# EAGLE design LedController3 (EAGLE 9.0.0)
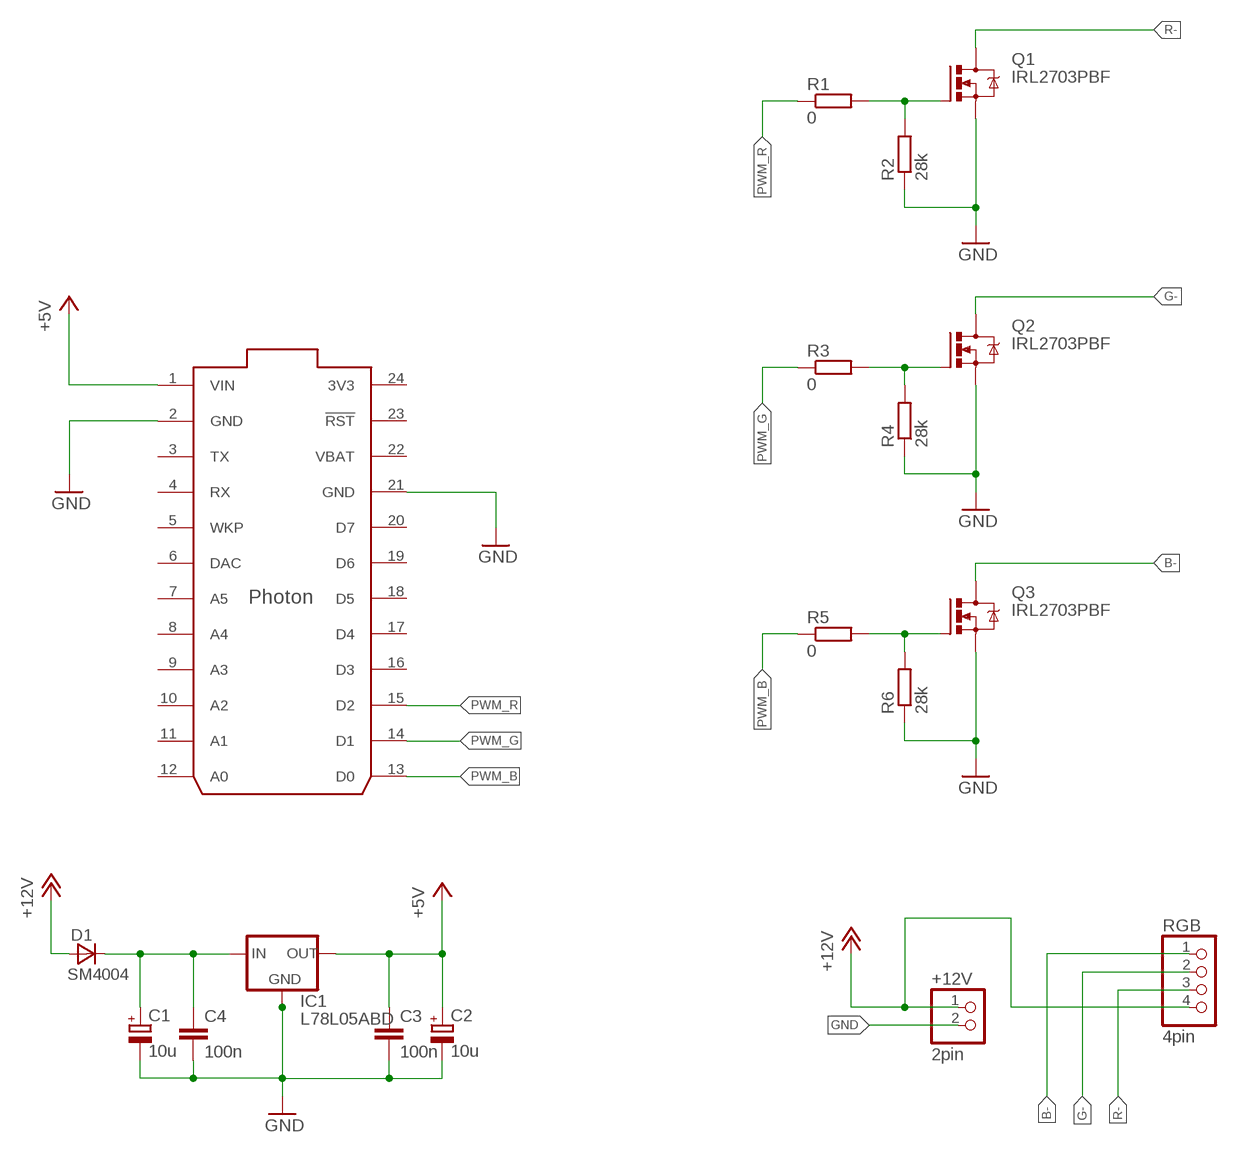
[diagram p0: schematic, sheet 1]

## Parts
+12V  2pin  PINHD-1X2  [1X02]
C1  10u  CPOL-EUSMCC  [SMC_C]
C2  10u  CPOL-EUSMCC  [SMC_C]
C3  100n  C-EUC0805  [C0805]
C4  100n  C-EUC0805  [C0805]
D1  SM4004  [MELF-MLL41]
IC1  L78L05ABD  L78LXXBD/CD  [SO08]
Q1  IRL2703PBF  IRF540  [TO220BV]
Q2  IRL2703PBF  IRF540  [TO220BV]
Q3  IRL2703PBF  IRF540  [TO220BV]
R1  0  R-EU_R0805  [R0805]
R2  28k  R-EU_R0805  [R0805]
R3  0  R-EU_R0805  [R0805]
R4  28k  R-EU_R0805  [R0805]
R5  0  R-EU_R0805  [R0805]
R6  28k  R-EU_R0805  [R0805]
RGB  4pin  PINHD-1X4  [1X04]
U$1  PHOTON_WITH_HEADERS  [PHOTON]

## Nets
+5V: C2.+ C3.1 IC1.1(OUT) U$1.1(VIN)
+12V: +12V.1 D1.A RGB.4
B-: Q3.D RGB.1
G-: Q2.D RGB.2
GND: +12V.2 C1.- C2.- C3.2 C4.2 IC1.2(GND1) IC1.3(GND2) IC1.6(GND3) IC1.7(GND4) Q1.S Q2.S Q3.S R2.1 R4.1 R6.1 U$1.2(GND) U$1.21(GND)
N$1: C1.+ C4.1 D1.C IC1.8(IN)
N$6: Q3.G R5.2 R6.2
N$7: Q2.G R3.2 R4.2
N$8: Q1.G R1.2 R2.2
PWM_B: R5.1 U$1.13(D0)
PWM_G: R3.1 U$1.14(D1)
PWM_R: R1.1 U$1.15(D2)
R-: Q1.D RGB.3
Unconnected: U$1.3(TX) U$1.4(RX) U$1.5(WKP) U$1.6(DAC) U$1.7(A5) U$1.8(A4) U$1.9(A3) U$1.10(A2) U$1.11(A1) U$1.12(A0) U$1.16(D3) U$1.17(D4) U$1.18(D5) U$1.19(D6) U$1.20(D7) U$1.23(!RST)

## Power pins joined to a net without a drawn wire
3V3: U$1.24(3V3)
VBAT: U$1.22(VBAT)

## Library data of the parts
+12V = pinhead:PINHD-1X2: PIN HEADER
C1 C2 = resistor:CPOL-EU: POLARIZED CAPACITOR, European symbol
C3 C4 = resistor:C-EU: CAPACITOR, European symbol
D1 = _mod_diode:SM400*: SM4001 .. SM4007 General Purpose Rectifier, 1 A SMD-Version of 1N4001 .. 1N4007 Case: MELF-MLL41 = DO 213 AB Author: Dipl.-Ing. FH Rainer Bayer HHN Hochschule Heilbronn, rainer.bayer@hs-heilbronn.de Ingenieurbüro ing-rb, mail@ing-rb.de
IC1 = v-reg:L78LXXBD/CD: VOLTAGE REGULATOR
Q1-Q3 = transistor-power:IRF540: HEXFET Power MOSFET
R1-R6 = resistor:R-EU_: RESISTOR, European symbol
RGB = pinhead:PINHD-1X4: PIN HEADER
U$1 = Spark:PHOTON

## Board
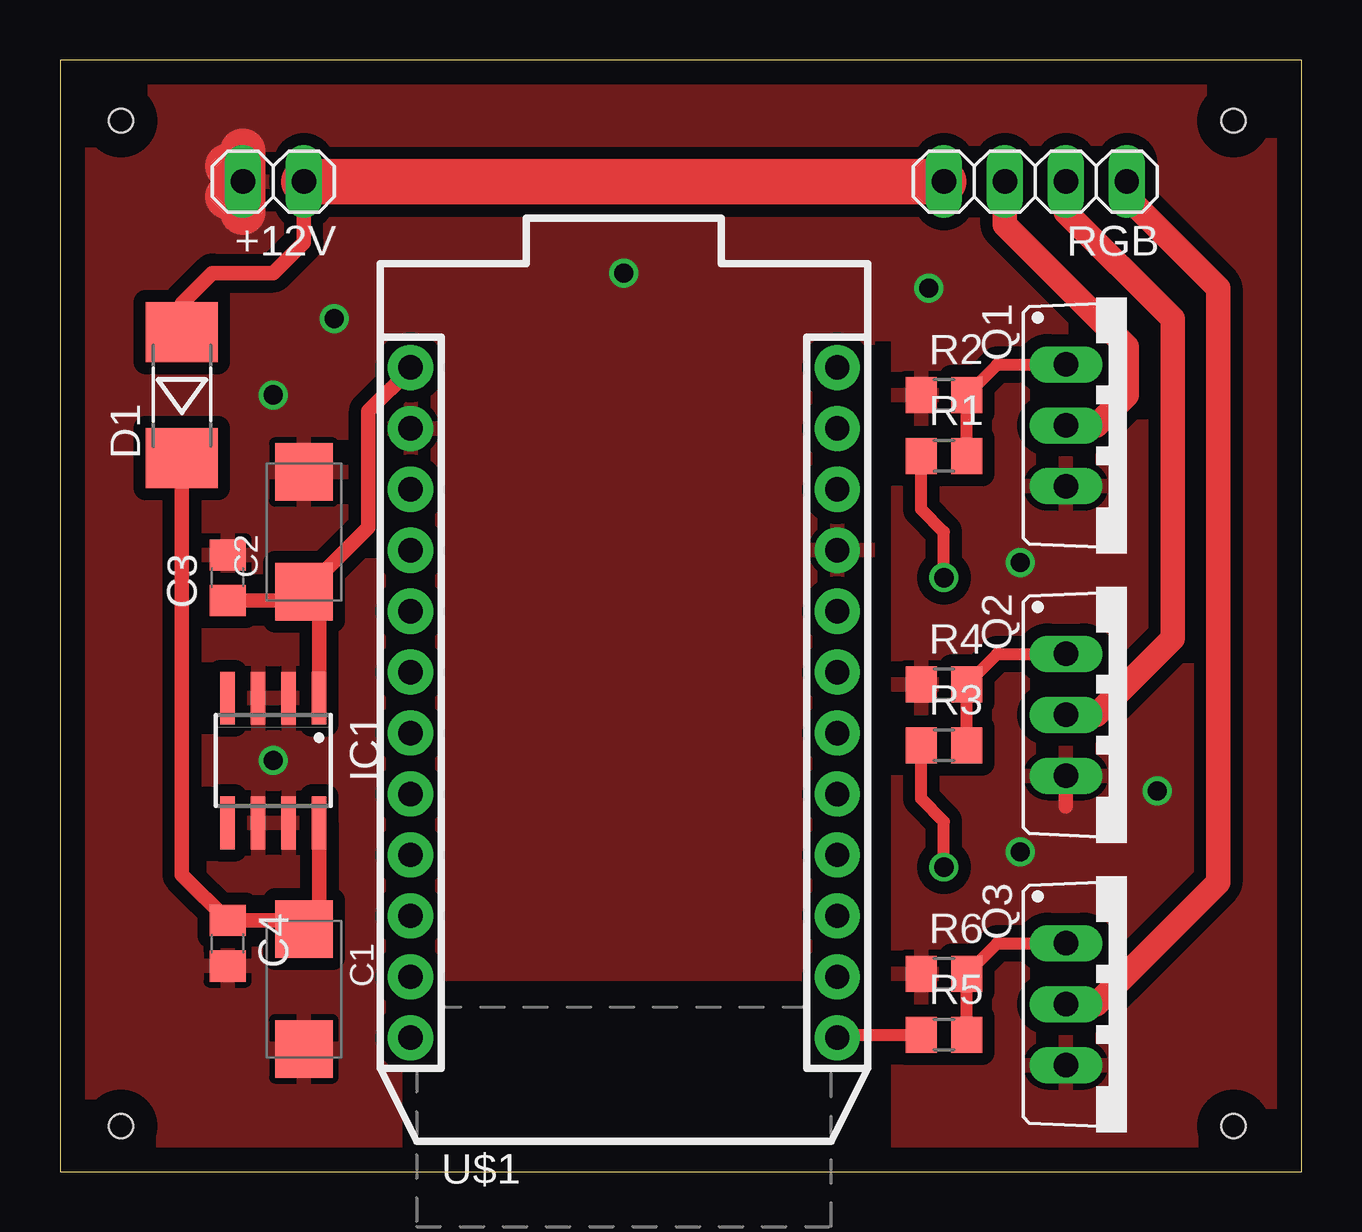
[diagram p1: board, top side]
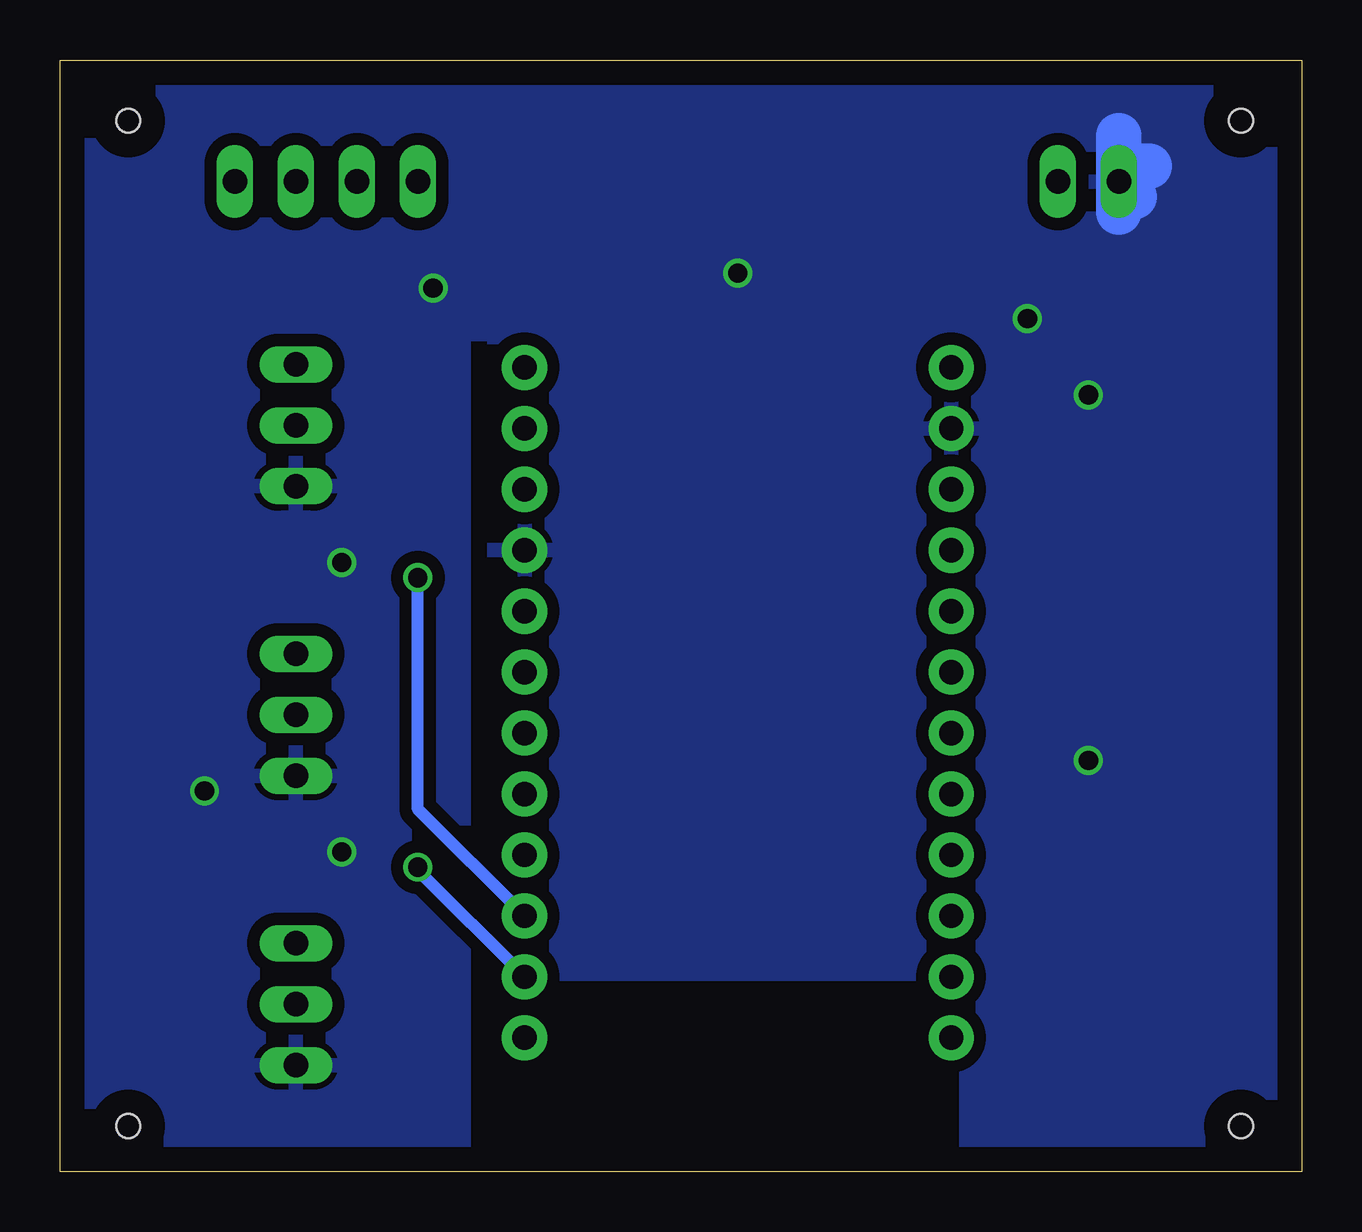
[diagram p2: board, bottom side, seen from below]

Size 51.74 x 46.34 mm. Coordinates in mm from the lower left corner, seen from the top.
Outline: 0,0 51.74,0 51.74,46.34 0,46.34 0,0
Copper layers (1*16): Top 0.035mm / dielectric 1.5mm / Bottom 0.035mm
Design rules "default *": minimum track width 6mil, minimum drill 0.35mm, track to track 20mil, track to pad 20mil, pad to pad 20mil, via to via 20mil, smd to smd 6mil, copper to edge 40mil, drill to drill 6mil, minimum pad ring 10mil, minimum via ring 8mil, stop-mask expansion 4mil, vias tented up to drill 0mil, thermal gap 10mil
Holes 1 mm at 48.9,43.81 2.54,43.81 48.9,1.91 2.54,1.91

### Footprints (pad centres in the part's own frame; a part is rotated, then mirrored left to right if it is on the bottom)
1X02 = drill 1.016 long: 1 -1.27,0; 2 1.27,0
SMC_C = smd 2.4 x 2.4: + -2.5,0; - 2.5,0
C0805 = smd 1.3 x 1.5: 1 -0.95,0; 2 0.95,0
MELF-MLL41 = smd 2.5 x 3: A 2.625,0; C -2.625,0
SO08 = smd 0.6 x 2.2: 1 -1.905,-2.6; 2 -0.635,-2.6; 3 0.635,-2.6; 4 1.905,-2.6; 5 1.905,2.6; 6 0.635,2.6; 7 -0.635,2.6; 8 -1.905,2.6
TO220BV = drill 1.016 long: D 0,-2.54; G -2.54,-2.54; S 2.54,-2.54
R0805 = smd 1.3 x 1.5: 1 -0.95,0; 2 0.95,0
1X04 = drill 1.016 long: 1 -3.81,0; 2 -1.27,0; 3 1.27,0; 4 3.81,0
PHOTON = drill 1.016 pad 1.88: 1 1.27,32.258; 2 1.27,29.718; 3 1.27,27.178; 4 1.27,24.638; 5 1.27,22.098; 6 1.27,19.558; 7 1.27,17.018; 8 1.27,14.478; 9 1.27,11.938; 10 1.27,9.398; 11 1.27,6.858; 12 1.27,4.318; 13 19.05,4.318; 14 19.05,6.858; 15 19.05,9.398; 16 19.05,11.938; 17 19.05,14.478; 18 19.05,17.018; 19 19.05,19.558; 20 19.05,22.098; 21 19.05,24.638; 22 19.05,27.178; 23 19.05,29.718; 24 19.05,32.258

### Placement (x,y rotation side)
+12V  8.89,41.27 180 top
C1  10.16,7.62 270 top
C2  10.16,26.67 90 top
C3  6.99,24.77 90 top
C4  6.99,9.53 270 top
D1  5.08,32.38 90 top
IC1  8.89,17.14 180 top
Q1  44.45,31.11 270 top
Q2  44.45,19.05 270 top
Q3  44.45,6.99 270 top
R1  36.83,29.84 0 top
R2  36.83,32.38 0 top
R3  36.83,17.78 0 top
R4  36.83,20.32 0 top
R5  36.83,5.71 0 top
R6  36.83,8.26 0 top
RGB  40.64,41.27 180 top
U$1  13.34,1.27 0 top

### Tracks (layer width: path | path; a pad name or v marks a point on that pad's centre or on a via)
+5V
  Top 0.61: IC1.1 10.79,23.5 | 10.79,23.5 10.79,23.54 | C3.1 9.8,23.82 C2.+ | C2.+ 12.85,26.86 12.85,31.71 14.61,33.47 U$1.1 | C2.+ 10.16,24.13 10.79,23.5
+12V
  Top 0.61: D1.A 5.08,36.2 6.35,37.47 8.89,37.47 10.16,38.73 +12V.1
  Top 1.905: +12V.1 RGB.4
B-
  Top 1.016: Q3.D 43.18,6.99 48.26,12.06 48.26,36.83 44.45,40.64 RGB.1
G-
  Top 1.016: Q2.D 43.18,19.05 46.35,22.23 46.35,35.56 41.91,40.01 RGB.2
GND  (via drill 0.8)
  Top 0.61: Q2.S 41.91,15.24
  Top 1.905: +12V.2 7.62,42.55 | +12V.2 7.62,40.01 | +12V.2 6.99,41.91 | +12V.2 6.99,40.64
  Bottom 1.905: +12V.2 7.62,43.18 | +12V.2 7.62,40.01 | +12V.2 6.99,41.91 6.35,41.91 | +12V.2 6.99,40.64
  other vias: 8.89,17.14 11.43,35.56 23.5,37.47 8.89,32.38 36.2,36.83 40.01,25.4 45.72,15.88 40.01,13.34
  pour Top: 13.97,0 13.97,6.35 15.88,8.26 33.66,8.26 33.66,46.35 0,46.35 0,0
  pour Top: 34.92,0 34.92,34.92 32.38,34.92 32.38,46.35 51.44,46.35 51.44,0
  pour Bottom: 0,46.35 33.66,46.35 33.66,8.26 15.88,8.26 13.97,5.71 13.97,0 0,0
  pour Bottom: 28.57,46.35 52.07,46.35 52.07,0 34.92,0 34.92,34.92 28.57,34.92
N$1
  Top 0.61: IC1.8 10.79,10.76 10.5,10.46 | 10.5,10.46 C1.+ | 10.5,10.46 10.48,10.47 C4.1 5.08,12.38 D1.C
N$6
  Top 0.508: R5.2 R6.2 39.05,9.53 Q3.G
N$7
  Top 0.508: R3.2 R4.2 39.05,21.59 Q2.G
N$8
  Top 0.508: R1.2 R2.2 39.05,33.66 Q1.G
PWM_B
  Top 0.508: U$1.13 32.51,5.71 R5.1
PWM_G  (via drill 0.8)
  Top 0.508: v36.83,12.7 36.83,14.61 35.88,15.55 R3.1
  Bottom 0.508: U$1.14 36.83,12.57 v36.83,12.7
PWM_R  (via drill 0.8)
  Top 0.508: v36.83,24.77 36.83,26.67 35.88,27.62 R1.1
  Bottom 0.508: U$1.15 36.83,15.11 v36.83,24.77
R-
  Top 1.016: Q1.D 43.18,31.11 44.45,32.38 44.45,34.39 39.37,39.47 RGB.3